# Altium schematic sheet ACDC.SchDoc
size A3; Organization: Miltera; Address1: Bilişim Vadisi Muallim Mah.; Address2: Deniz Cad.; Address3: No:143/5 A7 Blok; Address4: Kat:2 Kapı No:35; SheetNumber: 2; SheetTotal: 7
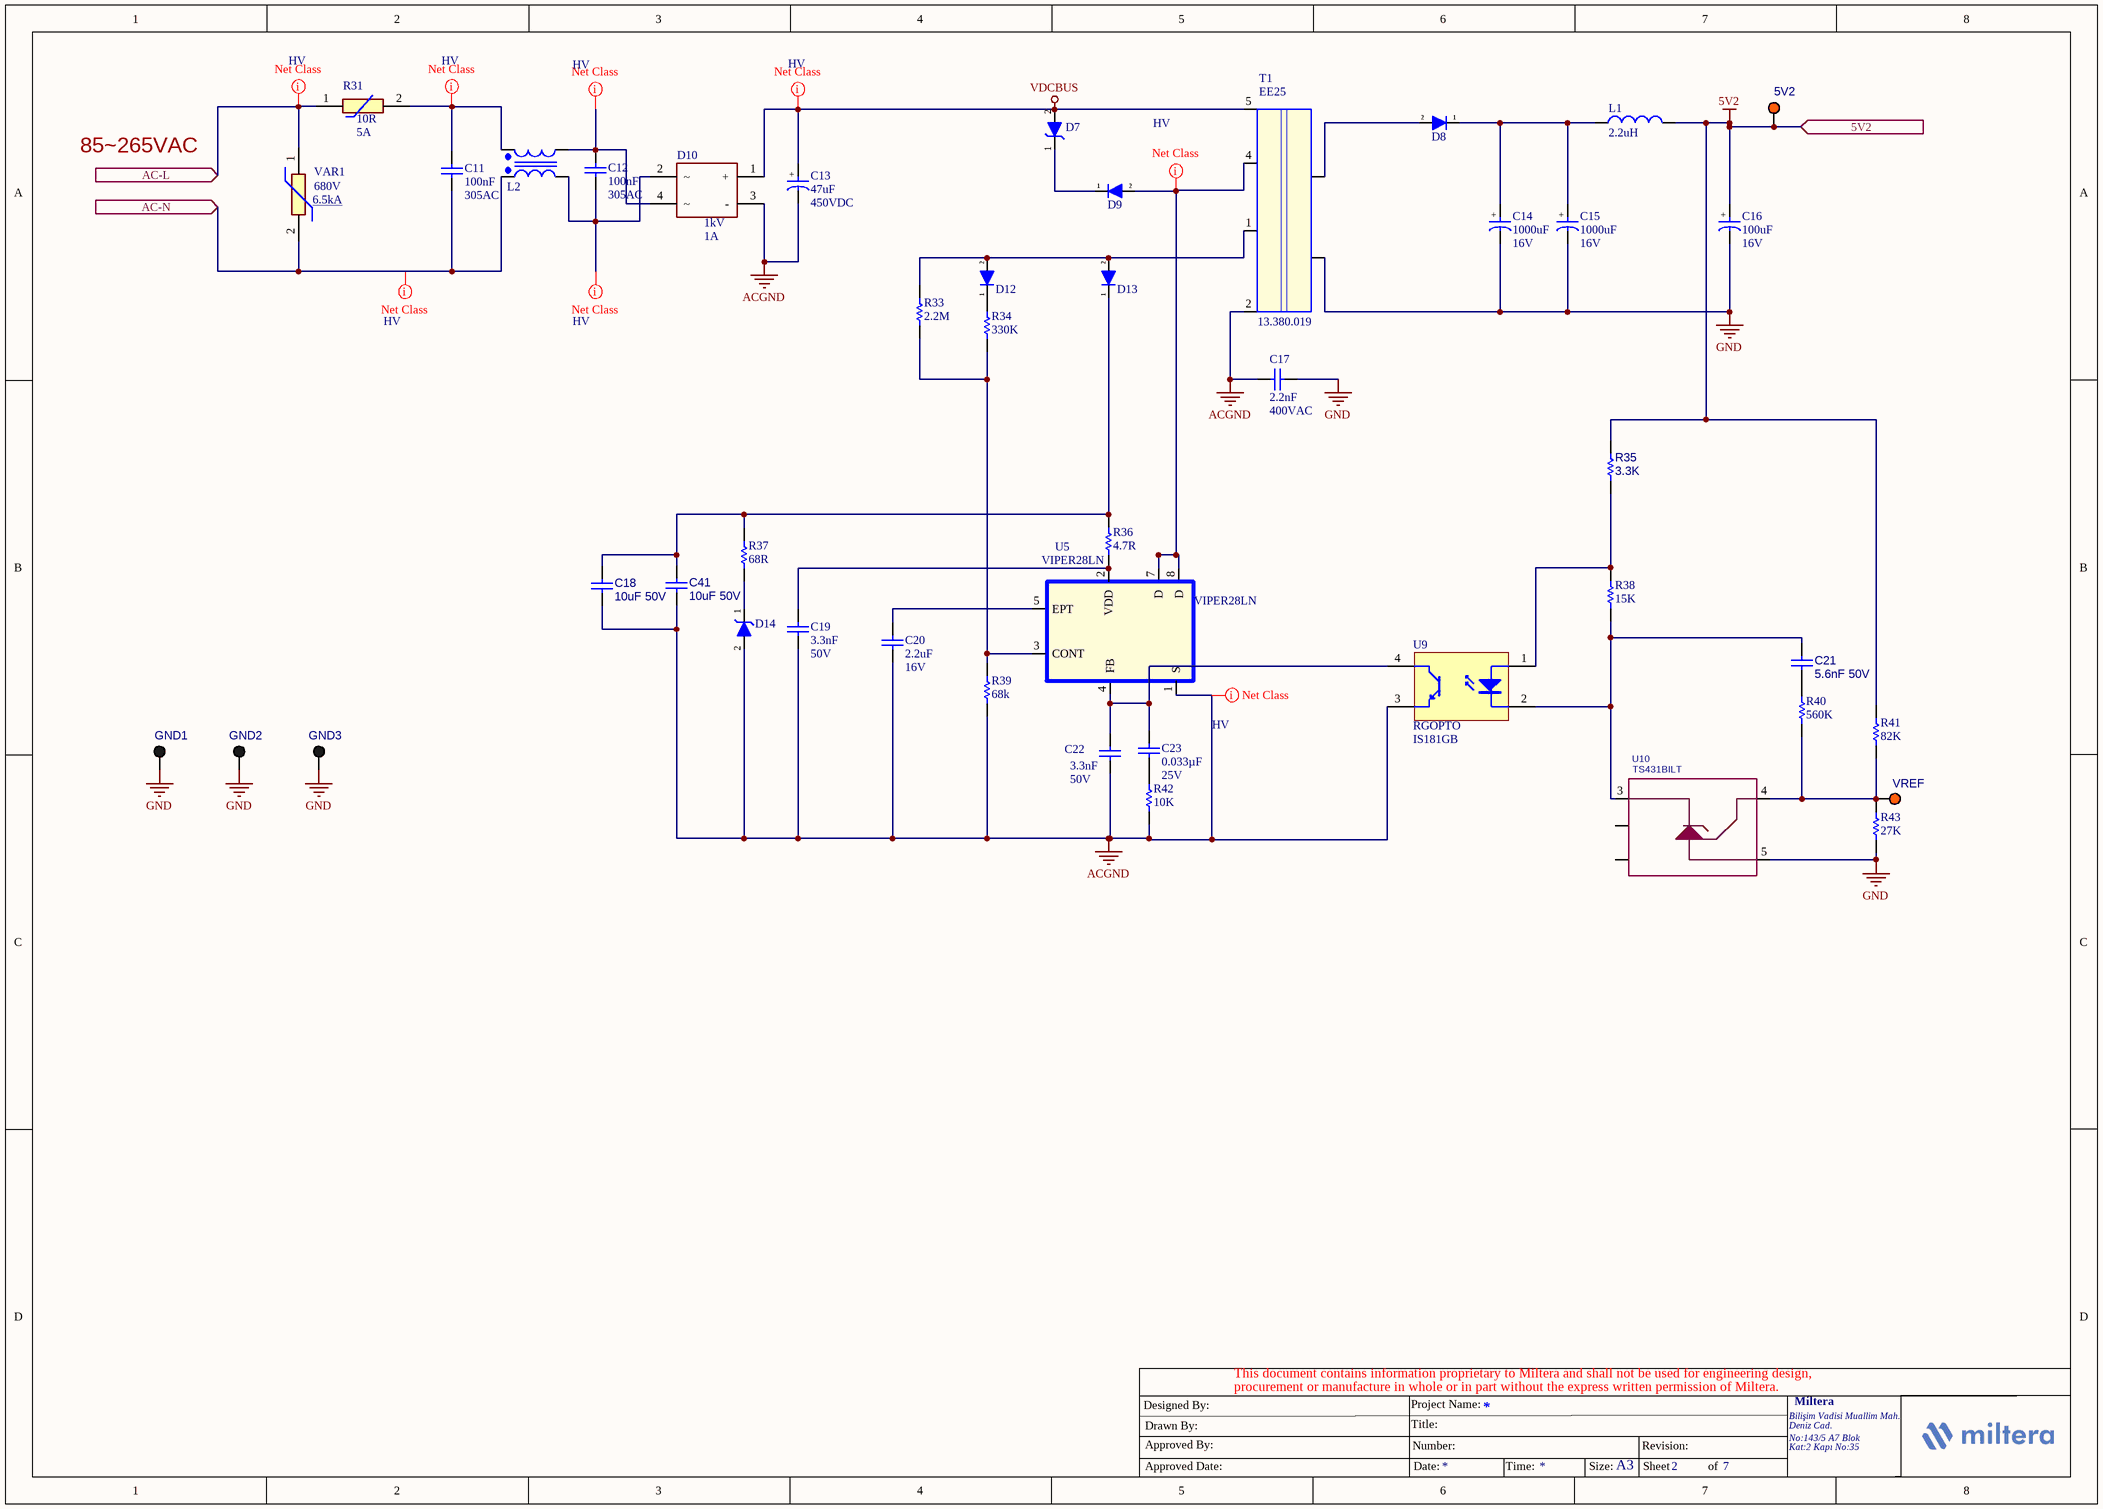
[diagram p0: ACDC.SchDoc]

## Parts
5V2  L-KLS8-TP5003  [TEST_POINT_ORANGE]  (value not drawn)
C11  value 100nF  Voltage: 305AC  [CAPRR1500W60L1725T850H1500A]  (hidden comment: CAP)
C12  value 100nF  Voltage: 305AC  [CAPRR1500W60L1725T850H1500A]  (hidden comment: CAP)
C13  value 47uF  Voltage: 450VDC  [CAPPRD750W80D1850H4250A]  (hidden comment: DHG450M476M230S1AA)
C14  value 1000uF  Voltage: 16V  [CAP_ALUM_SMD_10x10.2]  (hidden comment: CS1C102M-CRG10)
C15  value 1000uF  Voltage: 16V  [CAP_ALUM_SMD_10x10.2]  (hidden comment: CS1C102M-CRG10)
C16  value 100uF  Voltage: 16V  [CAP_ALUM_SMD_6.3x5.8]  (hidden comment: RVT100UF16V67RV0016)
C17  value 2.2nF  Voltage: 400VAC  [VAR_10mm]  (hidden comment: CAP)
C18  value 10uF 50V  [CAP_1206]  (hidden comment: CL31A106KBHNNNE)
C19  value 3.3nF  Voltage: 50V  [CAP_0603]  (hidden comment: CAP)
C20  value 2.2uF  Voltage: 16V  [CAP_0603]  (hidden comment: CAP)
C21  value 5.6nF 50V  [CAP_0603]  (hidden comment: CL10B562KB8NNNC)
C22  value 3.3nF  Voltage: 50V  [CAP_0603]  (hidden comment: CAP)
C23  value 0.033µF  Voltage: 25V  [CAP_0603]  (hidden comment: CAP)
C41  value 10uF 50V  [CAP_1206]  (hidden comment: CL31A106KBHNNNE)
D7  ZENER-SMB  [SMC]  (value not drawn)
D8  Diode-SMA  [SMC]  (value not drawn)
D9  Diode-SMA  [SMA]  (value not drawn)
D10  Current: 1A  Voltage: 1kV  [ABS20M13]  (hidden comment: ABS10)
D12  Diode-SMA  [SOD-323]  (value not drawn)
D13  Diode-SMA  [SOD-323]  (value not drawn)
D14  ZENER-SMB  [SOD-123]  (value not drawn)
GND1  L-KLS8-TP5001  [TEST_POINT_BLACK]  (value not drawn)
GND2  L-KLS8-TP5001  [TEST_POINT_BLACK]  (value not drawn)
GND3  L-KLS8-TP5001  [TEST_POINT_BLACK]  (value not drawn)
L1  value 2.2uH  [BOBIN5]  (hidden comment: IND)
L2  LFU09V  [LFU09V]  (value not drawn)
R31  value 10R  Current: 5A  [B57213P0100M351]  (hidden comment: B57213P0100M351)
R33  value 2.2M  [RES_0805]  (hidden comment: RES)
R34  value 330K  [RES_0603]  (hidden comment: RES)
R35  value 3.3K  [RES_0603]  (hidden comment: 0603SAF3301T5E)
R36  value 4.7R  [RES_0603]  (hidden comment: RES)
R37  value 68R  [RES_0603]  (hidden comment: RES)
R38  value 15K  [RES_0603]  (hidden comment: 0603SAF1502T5E)
R39  value 68k  [RES_0603]  (hidden comment: 0603SAF6802T5E)
R40  value 560K  [RES_0603]  (hidden comment: 0603SAF5603T5E)
R41  value 82K  [RES_0603]  (hidden comment: 0603SAF8202T5E)
R42  value 10K  [RES_0603]  (hidden comment: RES)
R43  value 27K  [RES_0603]  (hidden comment: 0603SAF2702T5E)
T1  EE25  [EE25]
U5  VIPER28LN  [DIP-7]
U9  RGOPTO  Manufacturer Part Number: IS181GB  [SOP(MF)254P700X200-4M]
U10  TS431BILT  [SOT23-5]
VAR1  Current: 6.5kA  Voltage: 680V  [MOV20D681K]  (hidden comment: MOV-20D681K)
VREF  L-KLS8-TP5003  [TEST_POINT_ORANGE]  (value not drawn)

## Ports
5V2 (in), AC-L (in), AC-N (in)

## Nets
5V2: 5V2.1 C16.2 L1.2 R35.2 R41.1 ; port 5V2
ACGND: C13.2 C17.1 C18.2 C19.2 C20.2 C22.2 C41.2 D10.3(-) D14.2(A) R39.2 R42.2 T1.2 U5.1(S) U9.3(C)
GND: C14.1 C15.1 C16.1 C17.2 GND1.1 GND2.1 GND3.1 R43.2 T1.6,7 U10.5(ANODE)
VDCBUS: C13.1 D7.2(A) D10.1(+) T1.5
AC-L: R31.1 VAR1.1 ; port AC-L
AC-N: C11.2 L2.2 VAR1.2 ; port AC-N
NetC11_1: C11.1 L2.3 R31.2
NetC12_1: C12.1 D10.4 L2.4
NetC12_2: C12.2 D10.2 L2.1
NetC14_2: C14.2 C15.2 D8.1 L1.1
NetC18_1: C18.1 C41.1 D13.1 R36.1 R37.1
NetC19_1: C19.1 R36.2 U5.2(VDD)
NetC20_1: C20.1 U5.5(EPT)
NetC21_1: C21.1 R38.2 U9.2(K) U10.3(CATHODE)
NetC21_2: C21.2 R40.1
NetC22_1: C22.1 C23.1 U5.4(FB) U9.4(E)
NetC23_2: C23.2 R42.1
NetD7_1: D7.1(K) D9.1
NetD8_2: D8.2 T1.9,10
NetD9_2: D9.2 T1.4 U5.7(D) U5.8(D)
NetD12_1: D12.1 R34.1
NetD12_2: D12.2 D13.2 R33.1 T1.1
NetD14_1: D14.1(K) R37.2
NetR33_2: R33.2 R34.2 R39.1 U5.3(CONT)
NetR35_1: R35.1 R38.1 U9.1(A)
NetR40_2: R40.2 R41.2 R43.1 U10.4(REFERENCE) VREF.1

Not connected (* = marked no-connect by the designer): U10 1(NC) 2(NC*)

## Layout directives
net class HV: AC-L, AC-N, ACGND, NetC11_1, NetC12_1, NetC12_2, NetD9_2, VDCBUS

## Notes on the sheet
- 85~265VAC
- This document contains information proprietary to Miltera and shall not be used for engineering design,
- procurement or manufacture in whole or in part without the express written permission of Miltera.
- Designed By:
- Drawn By:
- Approved By:
- Title:
- Project Name:
- Number:
- Revision:
- Approved Date:
- Date:
- Time:
- Size:
- A3
- Sheet
- of
- (in symbol C01792) +
- (in symbol C01819) +
- (in symbol C01821) +

## Library data of the parts
5V2 VREF = 5003: PC TEST POINT MINIATURE ORANGE 2.54MMX4.60MM; Manufacturer: KLS ELECTRONIC; Package: 1mm THT Pad; Manufacturer Part Number: L-KLS8-TP5003
C11 C12 = C01818: CAP.POL.100nF 305VAC 15MM 10% X2; Manufacturer: FARATRONIC; Manufacturer Part Number: C42Q2104K6SA605
C13 = C01819: CAP.EL.47uF 450V 16x23 7.5MM 105C 20% 5000H; Manufacturer: KNSCHA; Manufacturer Part Number: DHG450M476M230S1AA
C14 C15 = C01821: CAP.EL.1000uF 16V 10x10.5 105C 2000H SMT; Manufacturer: ROQANG; Manufacturer Part Number: CS1C102M-CRG10
C16 = C01792: CAP.EL.100uF 16V 6.3x5.4 105C 2000H SMD; Manufacturer: KNSCHA; Manufacturer Part Number: RVT100UF16V67RV0016
C17 = C01776: CAP.M/L 2.2nF 400VAC 10MM 20% X1Y2 BULK; Manufacturer: CINETECH; Manufacturer Part Number: JY222M2GY5VS95E
C18 C41 = CL31A106KBHNNNE: MLCC (3216) 1206 10uF 50VDC ±10% X5R; Manufacturer: SAMSUNG; Package: 1206 (3216 Metric); Manufacturer Part Number: CL31A106KBHNNNE
C19 C22 = C01787: MLCC 0603 3.3nF 50VDC ±10% X7R; Manufacturer: Samsung; Manufacturer Part Number: CL10B332KB8NNNC
C20 = C01768: MLCC 0603 2.2uF 16VDC ±10% X5R; Manufacturer: Samsung; Manufacturer Part Number: CL10A225KO8NNNC
C21 = CL10B562KB8NNNC: MLCC (1608) 0603 5.6nF 50VDC ±10% X7R; Manufacturer: SAMSUNG; Package: 0603 (1608 Metric); Manufacturer Part Number: CL10B562KB8NNNC
C23 = C00973: CAP CER 0.033UF 25V X7R 0603; Manufacturer: Murata Electronics North America; Manufacturer Part Number: GRM188R71E333JA01D
D7 = DIO00051: DIODE TVS 1500W 250V DO214AB (SMC) SMT; Manufacturer Part Number: SMCJ250A-TKS; Manufacturer: THINKING
D8 = DIO00043: DIODE SCHOTTKY 5A 60V SMC; Manufacturer Part Number: B560C-13-F; Manufacturer: Diodes Incorporated
D9 = DIO00036: DIODE 1A 600V SMA; Manufacturer Part Number: STTH1L06A; Manufacturer: STMicroelectronics
D10 = ABS20M-13: 3A 1V@400mA 1A 1kV ABS Bridge Rectifiers; Manufacturer: GOODWORK; Manufacturer Part Number: ABS10
D12 = DIO00039: DIODE FAST SWITCHING Single 200mA 75V SMT SOD323; Manufacturer Part Number: 1N4148WS_R1_00001; Manufacturer: PANJIT
D13 = DIO00035: DIODE SCHOTTKY 150mA 100V SOD-323; Manufacturer Part Number: BAT46JFILM; Manufacturer: STMicroelectronics
D14 = DIO00052: DIODE ZENER 18V 500mW SOD123; Manufacturer Part Number: MMSZ5248A_R1_00001; Manufacturer: PANJIT
GND1-GND3 = 5001: PC TEST POINT MINIATURE BLACK 2.54MMX4.60MM; Manufacturer: KLS ELECTRONIC; Package: 1mm THT Pad; Manufacturer Part Number: L-KLS8-TP5001
L1 = IND0000022: INDUCTOR POWER 2.2UH 6X6MM 4.2A SMD; Manufacturer: Core Master; Manufacturer Part Number: NR6028-2R2N
L2 = L000005: CHOKE COMMON MODE 18mH/1kHz; Manufacturer: Core Master; Manufacturer Part Number: LFU09V-183
R31 = B57213P0100M351: 10Ω 5A ±20% Through Hole,P=7.5mm Inrush Current Limiter; Manufacturer: TDK; Manufacturer Part Number: B57213P0100M351
R33 = R01913: RES SMD 2.2M OHM 1% 1/8W 0805; Manufacturer: Yageo; Manufacturer Part Number: RC0805FR-072M2L
R34 = R03107: RES 0603 330K Ohms 1% 1/10W-S 100PPM; Manufacturer: ROYALOHM; Manufacturer Part Number: 0603SAF3303T5E
R35 = 0603SAF3301T5E: RES.(1608) 0603 3.3K Ohms 1% 1/10W 100PPM SMT; Manufacturer: YAGEO; Manufacturer Part Number: RC0603FR-073K74L; Package: 0603 (1608 Metric)
R36 = R03016: RES 0603 4.7 Ohms 1% 1/10W-S 400PPM; Manufacturer: ROYALOHM; Manufacturer Part Number: 0603SAF470KT5E
R37 = R03109: RES 0603 68R Ohms 1% 1/10W-S 100PPM; Manufacturer: ROYALOHM; Manufacturer Part Number: 0603SAF680JT5E
R38 = R02998: RES.(1608) 0603 15K Ohms 1% 1/10W-S 100PPM; Manufacturer: ROYALOHM; Manufacturer Part Number: 0603SAF1502T5E
R39 = R03103: RES. 0603 68K Ohms 1% 1/10W-S 100PPM; Manufacturer: ROYALOHM; Manufacturer Part Number: 0603SAF6802T5E
R40 = R02998: RES.(1608) 0603 560K Ohms 1% 1/10W-S 100PPM; Manufacturer: ROYALOHM; Manufacturer Part Number: 0603SAF5603T5E
R41 = R03054: RES.(1608) 0603 82K Ohms 1% 1/10W-S 100PPM; Manufacturer: ROYALOHM; Manufacturer Part Number: 0603SAF8202T5E
R42 = R02995: RES 0603 10k Ohms %1 1/10W 100PPM; Manufacturer: ROYALOHM; Manufacturer Part Number: 0603SAF1002T5E
R43 = R03054: RES.(1608) 0603 27K Ohms 1% 1/10W-S 100PPM; Manufacturer: ROYALOHM; Manufacturer Part Number: 0603SAF2702T5E
T1 = P000211: Bobbin, EE25, Horizontal, 9 pins (4primary,5secondary); pin to pad: 6,7>6+7 9,10>9+10; Manufacturer: Sedasan; Manufacturer Part Number: 13.380.019
U5 = P000209: IC OFFLINE SWITCH FLYBACK 7DIP; Manufacturer: STMicroelectronics; Manufacturer Part Number: VIPER28LN
U9 = P000132: IC-181 SMD SO4 TR; Manufacturer: ISOCOM
U10 = TS431BILT: IC VREF SHUNT ADJ 0.5% SOT23-5; Manufacturer: STMicroelectronics; Manufacturer Part Number: TS431BILT; Value: TS431BILT
VAR1 = MOV-20D681K: VARISTOR 680V 6.5KA DISC 20MM; Manufacturer: Bourns Inc.; Manufacturer Part Number: MOV-20D681K